# EAGLE design main (EAGLE 9.2.2)
Assembly variants: co

## Sheet 1 of 8: PSU
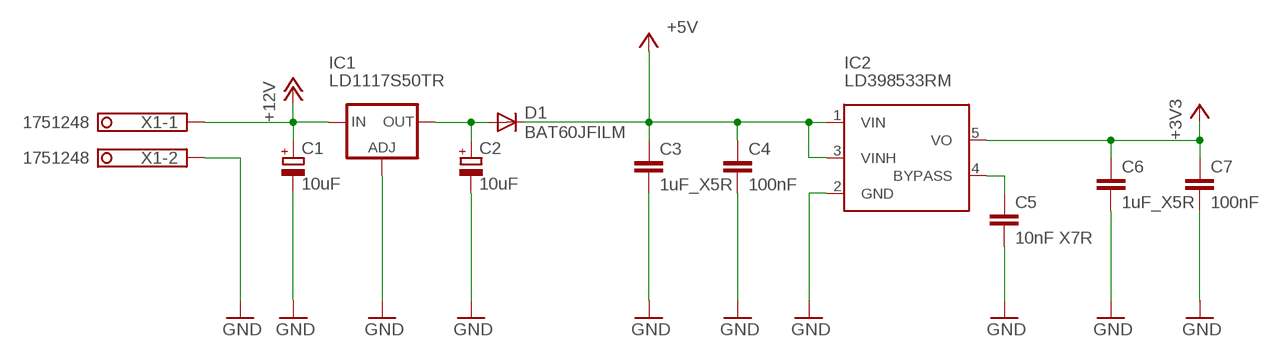
[diagram p0: schematic, sheet 1]

### Parts
C1  10uF  CPOL-EUSMCC  [SMC_C]
C2  10uF  CPOL-EUSMCC  [SMC_C]
C3  1uF_X5R  C-EUC0805  [C0805]
C4  100nF  C-EUC0805  [C0805]
C5  10nF X7R  C-EUC0805  [C0805]
C6  1uF_X5R  C-EUC0805  [C0805]
C7  100nF  C-EUC0805  [C0805]
D1  BAT60JFILM  DIODE-SOD323-W  [SOD323-W]
IC1  LD1117S50TR  LD117AS50TR  [SOT223]
IC2  LD398533RM  [SOT23-5L]
X1  1751248  [1751248]

### Nets
+3V3: C6.1 C7.1 IC2.5(VO) ; also sheet 2,3,4,5,6
+5V: C3.1 C4.1 D1.C IC2.1(VIN) IC2.3(VINH) ; also sheet 2,3,6
+12V [pwr]: C1.+ IC1.3(IN) X1.1 ; also sheet 7
GND [gnd]: C1.- C2.- C3.2 C4.2 C5.2 C6.2 C7.2 IC1.1(ADJ) IC2.2(GND) X1.2 ; also sheet 2,3,4,5,6,7
N$23: C2.+ D1.A IC1.4(OUT)
N$102: C5.1 IC2.4(BYPASS)

## Sheet 2 of 8: MCU
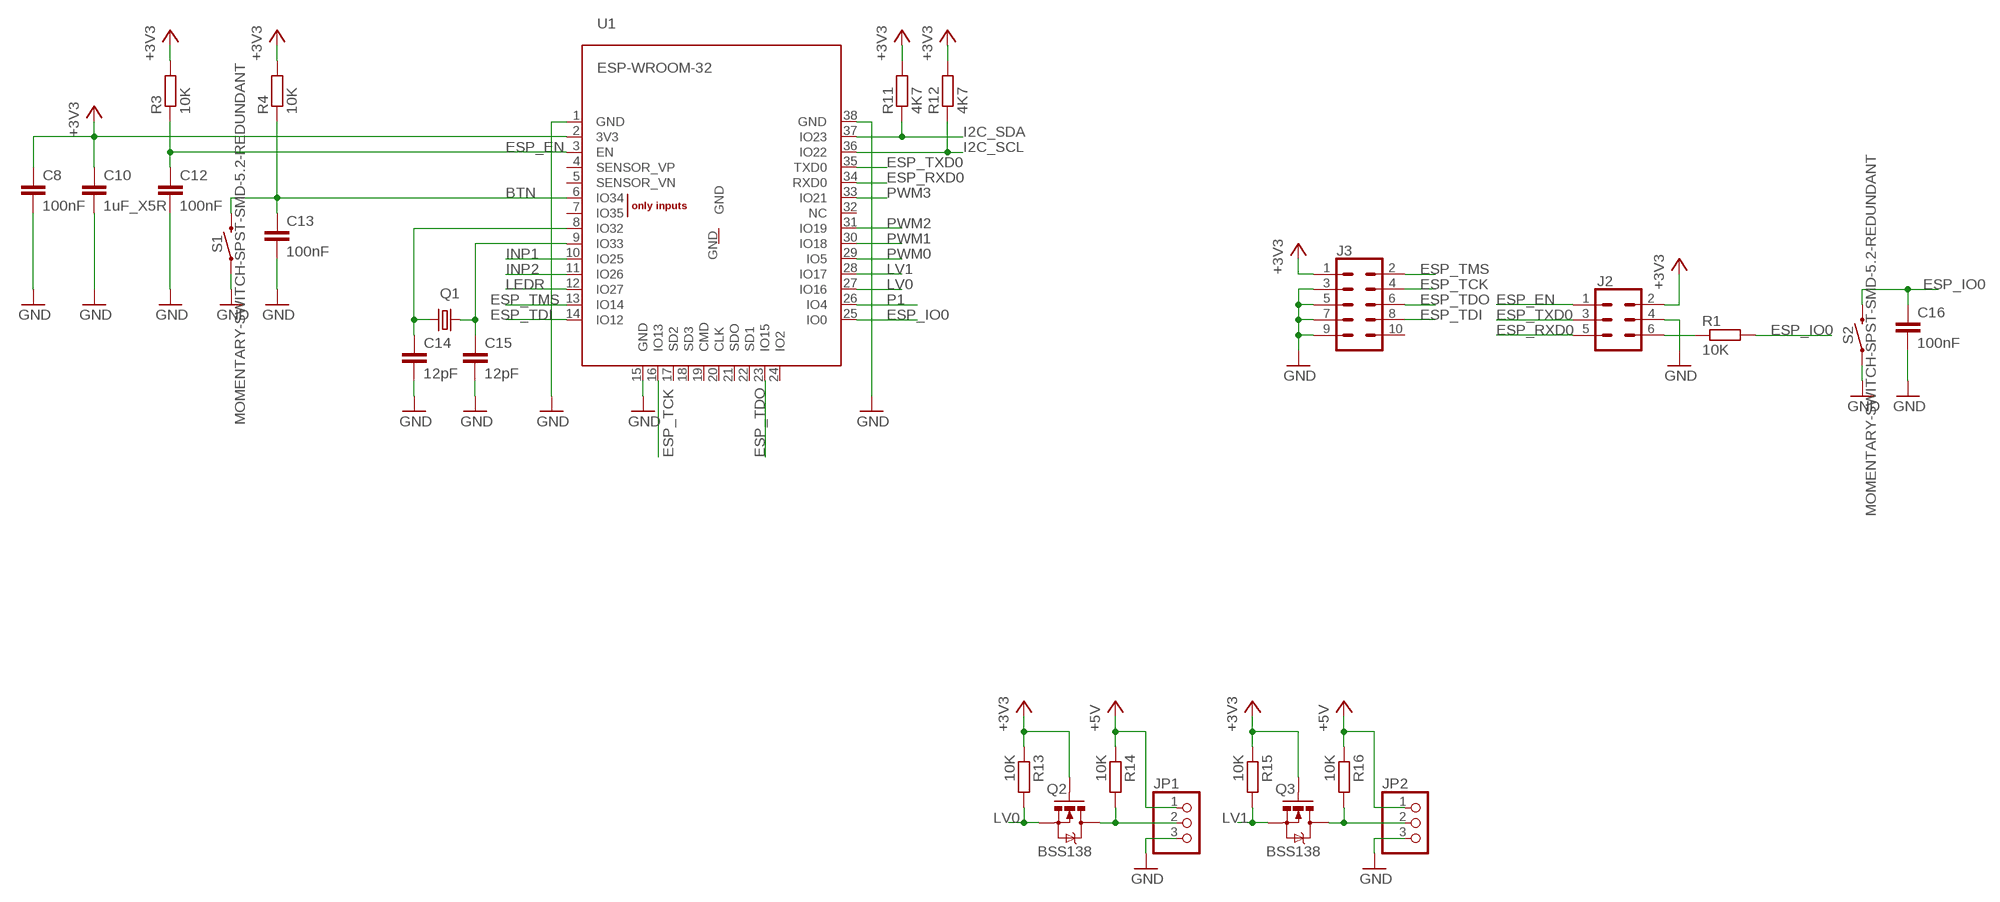
[diagram p1: schematic, sheet 2]

### Parts
C8  100nF  C-EUC0805  [C0805]
C10  1uF_X5R  C-EUC0805  [C0805]
C12  100nF  C-EUC0805  [C0805]
C13  100nF  C-EUC0805  [C0805]
C14  12pF  C-EUC0805  [C0805]
C15  12pF  C-EUC0805  [C0805]
C16  100nF  C-EUC0805  [C0805]
J2  CONN_03X2SHROUD  [2X3-SHROUDED]
J3  CONN_05X2SHD  [2X5-SHROUDED]
JP1  PINHD-1X3  [1X03]
JP2  PINHD-1X3  [1X03]
Q1  CRYSTALTC38H  [TC38H]
Q2  BSS138  MOSFET-NCHANNELSMD  [SOT23-3]
Q3  BSS138  MOSFET-NCHANNELSMD  [SOT23-3]
R1  10K  R-EU_R0805  [R0805]
R3  10K  R-EU_R0805  [R0805]
R4  10K  R-EU_R0805  [R0805]
R11  4K7  R-EU_R0805  [R0805]
R12  4K7  R-EU_R0805  [R0805]
R13  10K  R-EU_R0805  [R0805]
R14  10K  R-EU_R0805  [R0805]
R15  10K  R-EU_R0805  [R0805]
R16  10K  R-EU_R0805  [R0805]
S1  MOMENTARY-SWITCH-SPST-SMD-5.2-REDUNDANT  [TACTILE_SWITCH_SMD_5.2MM]
S2  MOMENTARY-SWITCH-SPST-SMD-5.2-REDUNDANT  [TACTILE_SWITCH_SMD_5.2MM]
U1  ESP-WROOM-32  [ESP-WROOM-32]

### Nets
+3V3: C8.1 C10.1 J2.2 J3.1 Q2.1(G) Q3.1(G) R3.2 R4.2 R11.2 R12.2 R13.1 R15.1 U1.2(3V3) ; also sheet 1,3,4,5,6
+5V: JP1.1 JP2.1 R14.1 R16.1 ; also sheet 1,3,6
BTN: C13.1 R4.1 S1.3 S1.4 U1.6(IO34)
ESP_EN: C12.1 J2.1 R3.1 U1.3(EN)
ESP_IO0: C16.1 R1.2 S2.3 S2.4 U1.25(IO0)
ESP_RXD0: J2.5 U1.34(RXD0)
ESP_TCK: J3.4 U1.16(IO13)
ESP_TDI: J3.8 U1.14(IO12)
ESP_TDO: J3.6 U1.23(IO15)
ESP_TMS: J3.2 U1.13(IO14)
ESP_TXD0: J2.3 U1.35(TXD0)
GND [gnd]: C8.2 C10.2 C12.2 C13.2 C14.2 C15.2 C16.2 J2.4 J3.3 J3.5 J3.7 J3.9 JP1.3 JP2.3 S1.1 S1.2 S2.1 S2.2 U1.1(GND) U1.15(GND) U1.38(GND) ; also sheet 1,3,4,5,6,7
HV1: JP1.2 Q2.3(D) R14.2
HV2: JP2.2 Q3.3(D) R16.2
I2C_SCL: R12.1 U1.36(IO22) ; also sheet 4
I2C_SDA: R11.1 U1.37(IO23) ; also sheet 4
INP1: U1.10(IO25) ; also sheet 3
INP2: U1.11(IO26) ; also sheet 3
LEDR: U1.12(IO27) ; also sheet 5
LV0: Q2.2(S) R13.2 U1.27(IO16)
LV1: Q3.2(S) R15.2 U1.28(IO17)
N$4: J2.6 R1.1
N$38: C14.1 Q1.2 U1.8(IO32)
N$39: C15.1 Q1.1 U1.9(IO33)
P1: U1.26(IO4) ; also sheet 6
PWM0: U1.29(IO5) ; also sheet 7
PWM1: U1.30(IO18) ; also sheet 7
PWM2: U1.31(IO19) ; also sheet 7
PWM3: U1.33(IO21) ; also sheet 7
Unconnected: J3.10 U1.4(SENSOR_VP) U1.5(SENSOR_VN) U1.7(IO35) U1.17(SD2) U1.18(SD3) U1.19(CMD) U1.20(CLK) U1.21(SDO) U1.22(SD1) U1.24(IO2) U1.32(NC) U1.GND

## Sheet 3 of 8: INPUTS
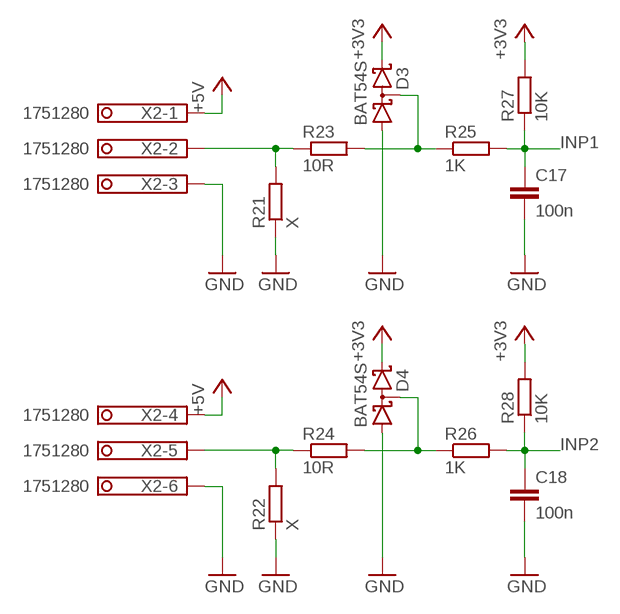
[diagram p2: schematic, sheet 3]

### Parts
C17  100n  C-EUC0805  [C0805]
C18  100n  C-EUC0805  [C0805]
D3  BAT54S  [SOT23]
D4  BAT54S  [SOT23]
R21  X  R-EU_R0805  [R0805]
R22  X  R-EU_R0805  [R0805]  (not fitted in variant co)
R23  10R  R-EU_R0805  [R0805]
R24  10R  R-EU_R0805  [R0805]
R25  1K  R-EU_R0805  [R0805]
R26  1K  R-EU_R0805  [R0805]
R27  10K  R-EU_R0805  [R0805]
R28  10K  R-EU_R0805  [R0805]
X2  1751280  [1751280]

### Nets
+3V3: D3.2(C2) D4.2(C2) R27.2 R28.2 ; also sheet 1,2,4,5,6
+5V: X2.1 X2.4 ; also sheet 1,2,6
GND [gnd]: C17.2 C18.2 D3.1(A1) D4.1(A1) R21.1 R22.1 X2.3 X2.6 ; also sheet 1,2,4,5,6,7
INP1: C17.1 R25.2 R27.1 ; also sheet 2
INP2: C18.1 R26.2 R28.1 ; also sheet 2
N$2: R22.2 R24.1 X2.5
N$3: D3.3(C1A2) R23.2 R25.1
N$8: D4.3(C1A2) R24.2 R26.1
N$20: R21.2 R23.1 X2.2

## Sheet 4 of 8: SENSOR
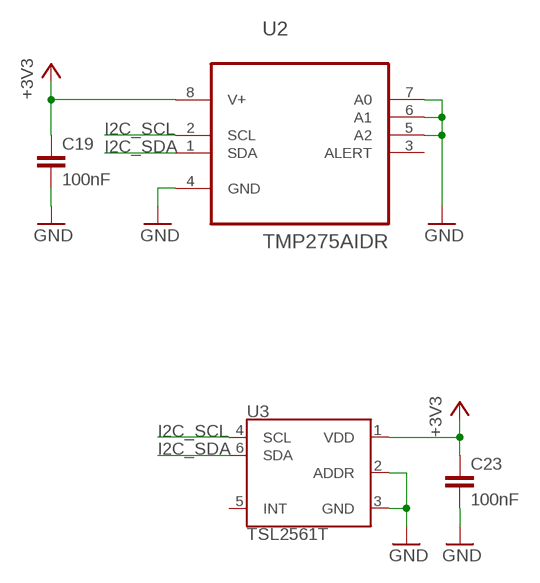
[diagram p3: schematic, sheet 4]

### Parts
C19  100nF  C-EUC0805  [C0805]
C23  100nF  C-EUC0805  [C0805]
U2  TMP275AIDR  [SOIC127P600X175-8N]
U3  TSL2561T  [TMB-6]

### Nets
+3V3: C19.1 C23.1 U2.8(V+) U3.1(VDD) ; also sheet 1,2,3,5,6
GND [gnd]: C19.2 C23.2 U2.4(GND) U2.5(A2) U2.6(A1) U2.7(A0) U3.2(ADDR) U3.3(GND) ; also sheet 1,2,3,5,6,7
I2C_SCL: U2.2(SCL) U3.4(SCL) ; also sheet 2
I2C_SDA: U2.1(SDA) U3.6(SDA) ; also sheet 2
Unconnected: U2.3(ALERT) U3.5(INT)

## Sheet 5 of 8: LED
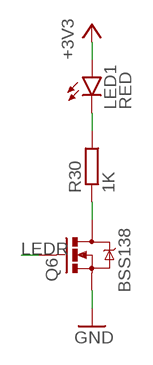
[diagram p4: schematic, sheet 5]

### Parts
LED1  RED  LEDCHIPLED_0805  [CHIPLED_0805]
Q6  BSS138  MOSFET-NCHANNELSMD  [SOT23-3]
R30  1K  R-EU_R0805  [R0805]

### Nets
+3V3: LED1.A ; also sheet 1,2,3,4,6
GND [gnd]: Q6.2(S) ; also sheet 1,2,3,4,6,7
LEDR: Q6.1(G) ; also sheet 2
N$1: Q6.3(D) R30.2
N$5: LED1.C R30.1

## Sheet 6 of 8: P1
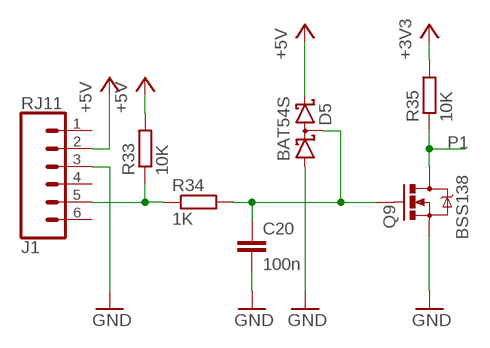
[diagram p5: schematic, sheet 6]

### Parts
C20  100n  C-EUC0805  [C0805]
D5  BAT54S  [SOT23]
J1  RJ11  RJ11-6  [RJ11-6]
Q9  BSS138  MOSFET-NCHANNELSMD  [SOT23-3]
R33  10K  R-EU_R0805  [R0805]
R34  1K  R-EU_R0805  [R0805]
R35  10K  R-EU_R0805  [R0805]

### Nets
+3V3: R35.2 ; also sheet 1,2,3,4,5
+5V: D5.2(C2) J1.2 R33.2 ; also sheet 1,2,3
GND [gnd]: C20.2 D5.1(A1) J1.3 Q9.2(S) ; also sheet 1,2,3,4,5,7
N$26: J1.5 R33.1 R34.1
N$27: C20.1 D5.3(C1A2) Q9.1(G) R34.2
P1: Q9.3(D) R35.1 ; also sheet 2
Unconnected: J1.1 J1.4 J1.6

## Sheet 7 of 8: OUTPUT-DRIVERS
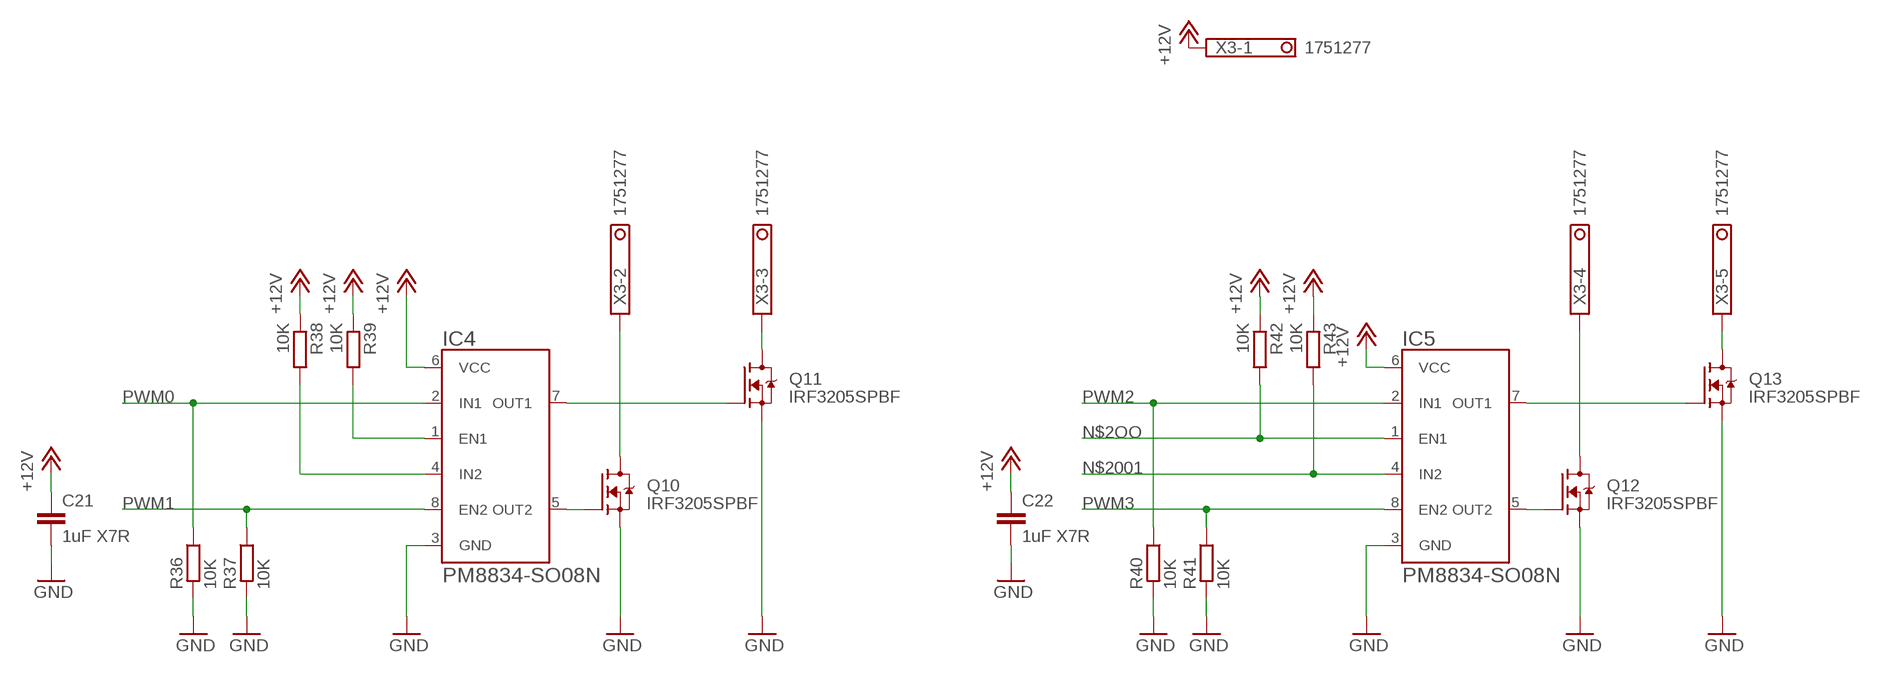
[diagram p6: schematic, sheet 7]

### Parts
C21  1uF X7R  C-EUC0805  [C0805]
C22  1uF X7R  C-EUC0805  [C0805]
IC4  PM8834-SO08N  [SO08N]
IC5  PM8834-SO08N  [SO08N]
Q10  IRF3205SPBF  [TRANS_IRF3205SPBF]
Q11  IRF3205SPBF  [TRANS_IRF3205SPBF]
Q12  IRF3205SPBF  [TRANS_IRF3205SPBF]
Q13  IRF3205SPBF  [TRANS_IRF3205SPBF]
R36  10K  R-EU_R0805  [R0805]
R37  10K  R-EU_R0805  [R0805]
R38  10K  R-EU_R0805  [R0805]
R39  10K  R-EU_R0805  [R0805]
R40  10K  R-EU_R0805  [R0805]
R41  10K  R-EU_R0805  [R0805]
R42  10K  R-EU_R0805  [R0805]
R43  10K  R-EU_R0805  [R0805]
X3  1751277  [1751277]

### Nets
+12V [pwr]: C21.1 C22.1 IC4.6(VCC) IC5.6(VCC) R38.2 R39.2 R42.2 R43.2 X3.1 ; also sheet 1
GND [gnd]: C21.2 C22.2 IC4.3(GND) IC5.3(GND) Q10.3(S) Q11.3(S) Q12.3(S) Q13.3(S) R36.2 R37.2 R40.2 R41.2 ; also sheet 1,2,3,4,5,6
N$2OO: IC5.1(EN1) R42.1
N$7 [pwr]: Q10.2(D) X3.2
N$9: IC4.1(EN1) R39.1
N$10: IC4.4(IN2) R38.1
N$12: IC4.7(OUT1) Q11.1(G)
N$13: IC4.5(OUT2) Q10.1(G)
N$14 [pwr]: Q11.2(D) X3.3
N$15: IC5.7(OUT1) Q13.1(G)
N$16: IC5.5(OUT2) Q12.1(G)
N$17 [pwr]: Q12.2(D) X3.4
N$18 [pwr]: Q13.2(D) X3.5
N$2001: IC5.4(IN2) R43.1
PWM0: IC4.2(IN1) R36.1 ; also sheet 2
PWM1: IC4.8(EN2) R37.1 ; also sheet 2
PWM2: IC5.2(IN1) R40.1 ; also sheet 2
PWM3: IC5.8(EN2) R41.1 ; also sheet 2

## Sheet 8 of 8: OUTLINE
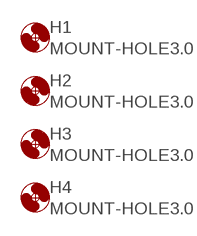
[diagram p7: schematic, sheet 8]

### Parts
H1  MOUNT-HOLE3.0  [3,0]
H2  MOUNT-HOLE3.0  [3,0]
H3  MOUNT-HOLE3.0  [3,0]
H4  MOUNT-HOLE3.0  [3,0]

## Library data of the parts
C1 C2 = resistor:CPOL-EU: POLARIZED CAPACITOR, European symbol
C3-C8 C10 C12-C23 = resistor:C-EU: CAPACITOR, European symbol
D1 = diode:DIODE-: DIODE
D3-D5 = diode:BAT54S: Schottky Diodes Pin connection corrected 2011-05-04 Source: Fairchild .. BAT54.pdf
H1-H4 = holes:MOUNT-HOLE: MOUNTING HOLE with drill center marker
IC1 = v-reg:LD117A?*: Low drop fixed and adjustable positive voltage regulators 1 A Source: http://www.st.com/stonline/products/literature/ds/7194/ld1117axx.pdf
IC2 = st-microelectronics:LD3985: Ultra low drop and low noise BiCMOS voltage regulators Source: www.st.com LD3985.pdf
IC4 IC5 = PM8834:PM8834: ST - PM8834 4A Dual, LowSide, PWM MOSFET Driver. http://www.st.com/stonline/products/literature/ds/15086/pm8834.pdf; AVAILABILITY: Unavailable; DESCRIPTION: PM8834 Series 18 V 4 A 1.3 Ohm SMT Dual Low Side MOSFET Driver - SOIC-8; MF: STMicroelectronics; MP: PM8834; PACKAGE: SOIC-8 STMicroelectronics; PRICE: None
J1 = SparkFun-Connectors:RJ11-6: RJ11 Jack - 6 pin Commonly found on CAT3 devices and some Microchip programmers. Here is the connector we sell at SparkFun: RJ11 6-Pin Connector <https://www.sparkfun.com/products/132> (PRT-00132) Datasheet <http://www.sparkfun.com/datasheets/Prototyping/Connectors/RJ11-Datasheet.pdf> It is used on this SparkFun product: SparkFun Weather Shield <https://www.sparkfun.com/products/12081> (DEV-12081) Weather Meters <https://www.sparkfun.com/products/8942> (SEN-08942); PROD_ID: CONN-08590; SF_ID: PRT-00132
J2 = SparkFun-Connectors:CONN_03X2: Multi connection point. Often used as Generic Header-pin footprint for 0.1 inch spaced/style header connections You can populate with any combo of single row headers, but if you'd like an exact match, check these: Header - 2x3 (Male, 0.1") <https://www.sparkfun.com/products/12807> (PRT-12807) Header - 2x3 (Female, 0.1") <https://www.sparkfun.com/products/13010> (PRT-13010) 2x3 Pin Shrouded Header <https://www.sparkfun.com/products/10877> (PRT-10877) On any of the 0.1 inch spaced packages, you can populate with these: Break Away Headers - Straight <https://www.sparkfun.com/products/116> (PRT-00116) Break Away Male Headers - Right Angle <https://www.sparkfun.com/products/553> (PRT-00553) Female Headers <https://www.sparkfun.com/products/115> (PRT-00115) Break Away Headers - Machine Pin <https://www.sparkfun.com/products/117> (PRT-00117) Break Away Female Headers - Swiss Machine Pin <https://www.sparkfun.com/products/743> (PRT-00743) Special note: the shrouded connector mates well with our 3x2 ribbon cables: Ribbon Crimp Connector - 6-pin (2x3, Female) <https://www.sparkfun.com/products/10651> (PRT-10651) Ribbon Cable - 6 wire (15ft) <https://www.sparkfun.com/products/10646> (PRT-10646); PROD_ID: CONN-10681; SF_ID: PRT_10877
J3 = SparkFun-Connectors:CONN_05X2: Multi connection point. Often used as Generic Header-pin footprint for 0.1 inch spaced/style header connections For AVR SPI programming port, see special device with nice symbol: "AVR_SPI_PROG_5x2.dev" You can populate with any combo of single row headers, but if you'd like an exact match, check these: 2x5 AVR ICSP Male Header <https://www.sparkfun.com/products/778> (PRT-00778) 2x5 Pin Shrouded Header <https://www.sparkfun.com/products/8506> (PRT-08506) On any of the 0.1 inch spaced packages, you can populate with these: Break Away Headers - Straight <https://www.sparkfun.com/products/116> (PRT-00116) Break Away Male Headers - Right Angle <https://www.sparkfun.com/products/553> (PRT-00553) Female Headers <https://www.sparkfun.com/products/115> (PRT-00115) Break Away Headers - Machine Pin <https://www.sparkfun.com/products/117> (PRT-00117) Break Away Female Headers - Swiss Machine Pin <https://www.sparkfun.com/products/743> (PRT-00743) Special note: the shrouded connector mates well with our 5x2 ribbon cables: 2x5 Pin IDC Ribbon Cable <https://www.sparkfun.com/products/8535> (PRT-08535); PROD_ID: CONN-08671; SF_ID: PRT-08506
JP1 JP2 = adafruit:PINHD-1X3: PIN HEADER
LED1 = led:LED: LED OSRAM: - CHIPLED LG R971, LG N971, LY N971, LG Q971, LY Q971, LO R971, LY R971 LH N974, LH R974 LS Q976, LO Q976, LY Q976 LO Q996 - Hyper CHIPLED LW Q18S LB Q993, LB Q99A, LB R99A - SideLED LS A670, LO A670, LY A670, LG A670, LP A670 LB A673, LV A673, LT A673, LW A673 LH A674 LY A675 LS A676, LA A676, LO A676, LY A676, LW A676 LS A679, LY A679, LG A679 - Hyper Micro SIDELED® LS Y876, LA Y876, LO Y876, LY Y876 LT Y87S - SmartLED LW L88C, LW L88S LB L89C, LB L89S, LG L890 LS L89K, LO L89K, LY L89K LS L896, LA L896, LO L896, LY L896 - TOPLED LS T670, LO T670, LY T670, LG T670, LP T670 LSG T670, LSP T670, LSY T670, LOP T670, LYG T670 LG T671, LOG T671, LSG T671 LB T673, LV T673, LT T673, LW T673 LH T674 LS T676, LA T676, LO T676, LY T676, LB T676, LH T676, LSB T676, LW T676 LB T67C, LV T67C, LT T67C, LS T67K, LO T67K, LY T67K, LW E67C LS E67B, LA E67B, LO E67B, LY E67B, LB E67C, LV E67C, LT E67C LW T67C LS T679, LY T679, LG T679 LS T770, LO T770, LY T770, LG T770, LP T770 LB T773, LV T773, LT T773, LW T773 LH T774 LS E675, LA E675, LY E675, LS T675 LS T776, LA T776, LO T776, LY T776, LB T776 LHGB T686 LT T68C, LB T68C - Hyper Mini TOPLED® LB M676 - Mini TOPLED Santana® LG M470 LS M47K, LO M47K, LY M47K Source: http://www.osram.convergy.de LUXEON: - LUMILED® LXK2-PW12-R00, LXK2-PW12-S00, LXK2-PW14-U00, LXK2-PW14-V00 LXK2-PM12-R00, LXK2-PM12-S00, LXK2-PM14-U00 LXK2-PE12-Q00, LXK2-PE12-R00, LXK2-PE12-S00, LXK2-PE14-T00, LXK2-PE14-U00 LXK2-PB12-K00, LXK2-PB12-L00, LXK2-PB12-M00, LXK2-PB14-N00, LXK2-PB14-P00, LXK2-PB14-Q00 LXK2-PR12-L00, LXK2-PR12-M00, LXK2-PR14-Q00, LXK2-PR14-R00 LXK2-PD12-Q00, LXK2-PD12-R00, LXK2-PD12-S00 LXK2-PH12-R00, LXK2-PH12-S00 LXK2-PL12-P00, LXK2-PL12-Q00, LXK2-PL12-R00 Source: www.luxeon.com KINGBRIGHT: KA-3528ASYC Source: www.kingbright.com
Q1 = crystal:CRYSTAL: CRYSTAL; OC_FARNELL: unknown; OC_NEWARK: unknown
Q2 Q3 Q6 Q9 = SparkFun:MOSFET-NCHANNEL
Q10-Q13 = IRF3205SPBF:IRF3205SPBF: Single N-Channel 55 V 200 W 146 nC Hexfet Power Mosfet Surface Mount - D2PAK-3; AVAILABILITY: Unavailable; DESCRIPTION: Single N-Channel 55 V 200 W 146 nC Hexfet Power Mosfet Surface Mount - D2PAK-3; MF: Infineon Technologies; MP: IRF3205SPBF; PACKAGE: D2PAK Infineon; PRICE: None
R1 R3 R4 R11-R16 R21-R28 R30 R33-R43 = resistor:R-EU_: RESISTOR, European symbol
S1 S2 = SparkFun-Switches:MOMENTARY-SWITCH-SPST: Momentary Switch (Pushbutton) - SPST Normally-open (NO) SPST momentary switches (buttons, pushbuttons). Variants PTH-12MM - 12mm square, through-hole Momentary Pushbutton Switch - 12mm Square <https://www.sparkfun.com/products/9190> (COM-09190) PTH-6.0MM, PTH-6.0MM-KIT - 6.0mm square, through-hole Mini Pushbutton Switch <https://www.sparkfun.com/products/97> (COM-00097) KIT package intended for soldering kit's - only one side of pads' copper is exposed. PTH-RIGHT-ANGLE-KIT - Right-angle, through-hole Right Angle Tactile Button <https://www.sparkfun.com/products/10791> - Used on SparkFun BigTime Watch Kit <https://www.sparkfun.com/products/11734> SMD-12MM - 12mm square, surface-mount Tactile Button - SMD (12mm) <https://www.sparkfun.com/products/12993> (COM-12993) Used on SparkFun PicoBoard <https://www.sparkfun.com/products/11888> SMD-4.5MM - 4.5mm Square Trackball Switch Used on SparkFun Blackberry Trackballer Breakout <https://www.sparkfun.com/products/13169> SMD-4.6MMX2.8MM - 4.60mm x 2.80mm, surface mount Used on SparkFun SAMD21 Mini Breakout <https://www.sparkfun.com/products/13664> SMD-5.2MM, SMD-5.2-REDUNDANT - 5.2mm square, surface-mount Mini Pushbutton Switch - SMD <https://www.sparkfun.com/products/8720> (COM-08720) Used on Arduino Pro Mini <https://www.sparkfun.com/products/11114> REDUNDANT package connects both switch circuits together SMD-6.0X3.5MM - 6.0 x 3.5mm, surface mount Momentary Reset Switch SMD <https://www.sparkfun.com/products/8229> (COM-08229) SMD-6.2MM-TALL - 6.2mm square, surface mount Tactile Button - SMD (6mm) <https://www.sparkfun.com/products/12992> Used on SparkFun Digital Sandbox <https://www.sparkfun.com/products/12651> SMD-RIGHT-ANGLE - Right-angle, surface mount Used on SparkFun Block for Intel® Edison - Arduino <https://www.sparkfun.com/products/13036>; PROD_ID: SWCH-08247; SF_SKU: COM-08720
U1 = esp32:ESP-WROOM-32
U2 = TMP275AIDR:TMP275AIDR: 0.5°C Digital Out Temperature Sensor; AVAILABILITY: Unavailable; DESCRIPTION: ?0.5?C _max_ Temperature Sensor with I2C/SMBus Interface in Industry Standard LM75 Form Factor & Pin 8-SOIC -40 to 125; MF: Texas Instruments; MP: TMP275AIDR; PACKAGE: SOIC-8 Texas Instruments; PRICE: None
U3 = SparkFun-Sensors:TSL2561: TAOS TSL2561 Digital Luminosity (Light) Sensor The TSL2561 is a light-to-digital converter that transform light intensity to a digital signal output via I2C interface. The device combines one broadband photodiode (visible plus infrared) and one infrared-responding photodiode on a single CMOS integrated circuit capable of providing a near-photopic response over an effective 20-bit dynamic range (16-bit resolution). Two integrating ADCs convert the photodiode currents to a digital output that represents the irradiance measured on each channel. This digital output can be input to a microprocessor where illuminance (ambient light level) in lux is derived using an empirical formula to approximate the human eye response. The TSL2561 device supports a traditional level style interrupt that remains asserted until the firmware clears it. Datasheet <http://www.mouser.com/ds/2/588/ams_sl2560-e58-488842.pdf> SparkFun Products SparkFun Luminosity Sensor Breakout - TSL2561 <https://www.sparkfun.com/products/12055> (SEN-12055)
X1 = con-phoenix-350:1751248: MKDS 1/ 2-3,5 Printklemme Nennstrom: 10 A Bemessungsspannung: 160 V Raster: 3,5 mm Polzahl: 2 Montageart: Löten Anschlussart: Schraubanschluss Anschlussrichtung vom Leiter zur Platine: 0° Source: http://eshop.phoenixcontact.com .. 1751248.pdf; OC_FARNELL: unknown; OC_NEWARK: unknown
X2 = con-phoenix-350:1751280: MKDS 1/ 6-3,5 Printklemme Nennstrom: 10 A Bemessungsspannung: 160 V Raster: 3,5 mm Polzahl: 6 Montageart: Löten Anschlussart: Schraubanschluss Anschlussrichtung vom Leiter zur Platine: 0° Source: http://eshop.phoenixcontact.com .. 1751280.pdf; MPN: 1751280; OC_FARNELL: unknown; OC_NEWARK: 27R1765
X3 = con-phoenix-350:1751277: MKDS 1/ 5-3,5 Printklemme Nennstrom: 10 A Bemessungsspannung: 160 V Raster: 3,5 mm Polzahl: 5 Montageart: Löten Anschlussart: Schraubanschluss Anschlussrichtung vom Leiter zur Platine: 0° Source: http://eshop.phoenixcontact.com .. 1751277.pdf; OC_FARNELL: unknown; OC_NEWARK: unknown

## Net classes
0 default: width 0.305 mm
1 pwr: width 0.305 mm
2 gnd: width 0.305 mm, drill 0.559 mm, clearance 0.152 mm

## Board
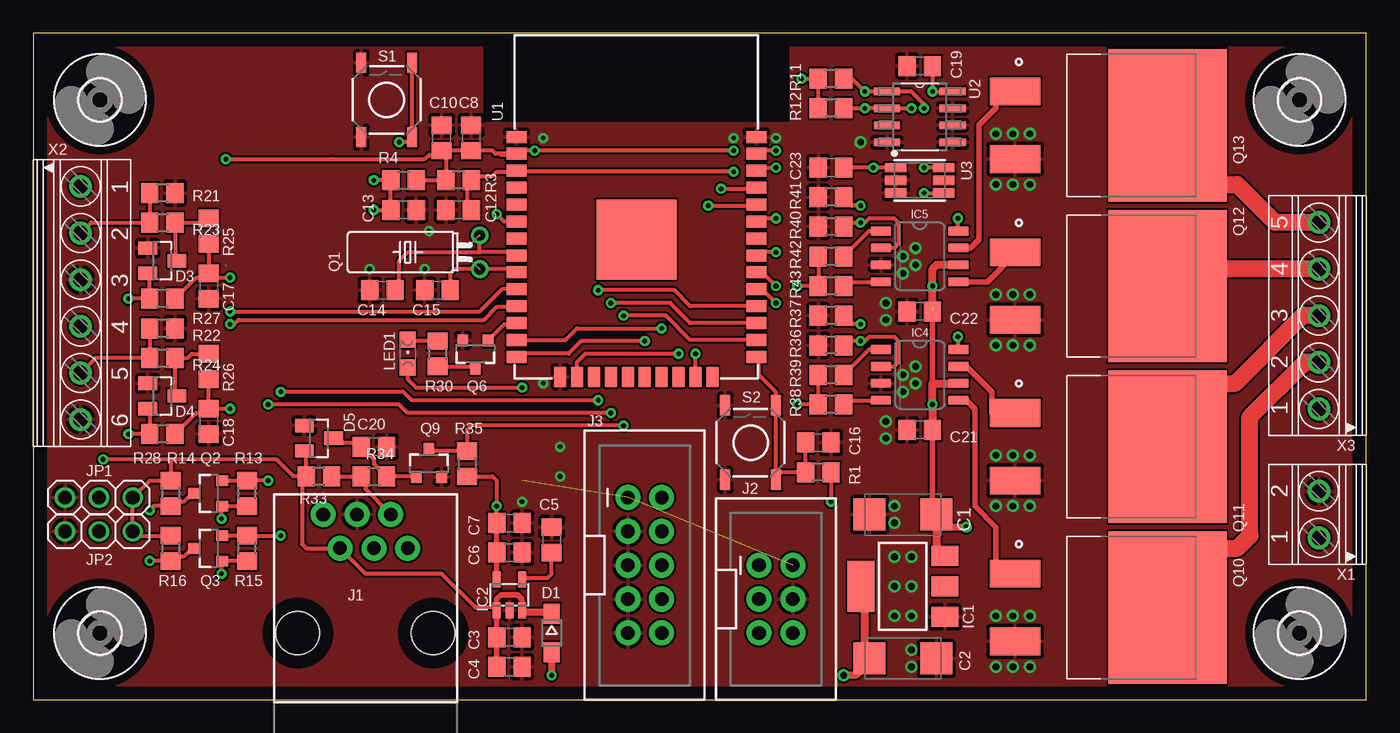
[diagram p8: board, top side]
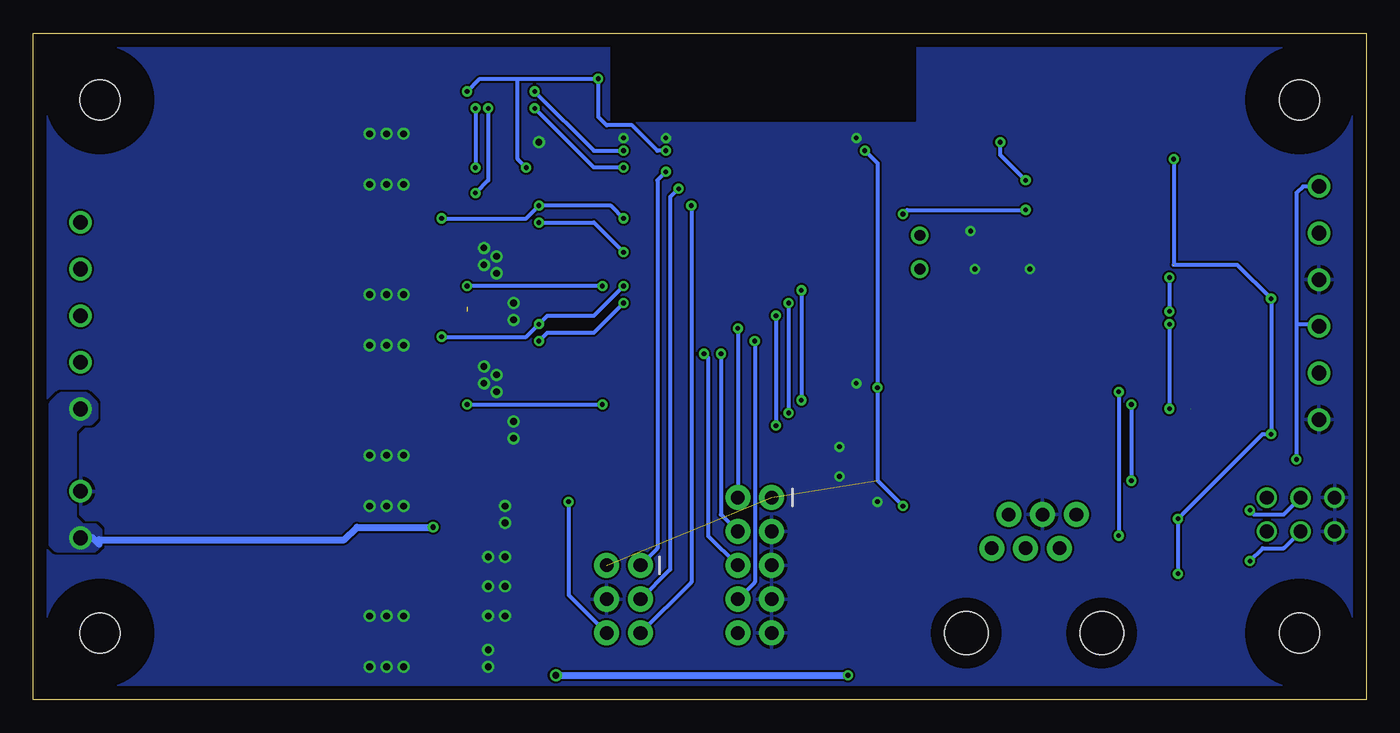
[diagram p9: board, bottom side, seen from below]

Size 100 x 50 mm. Coordinates in mm from the lower left corner, seen from the top.
Outline: 0,0 100,0 100,50 0,50 0,0
Copper layers (1*16): Top 0.035mm / dielectric 1.5mm / Bottom 0.035mm
Design rules "default": minimum track width 6mil, minimum drill 0.35mm, track to track 6mil, track to pad 6mil, pad to pad 6mil, via to via 6mil, smd to smd 6mil, copper to edge 40mil, drill to drill 6mil, minimum pad ring 10mil, minimum via ring 8mil, stop-mask expansion 4mil, vias tented up to drill 0mil, thermal gap 10mil

### Footprints (pad centres in the part's own frame; a part is rotated, then mirrored left to right if it is on the bottom)
SMC_C = smd 2.4 x 2.4: + -2.5,0; - 2.5,0
C0805 = smd 1.3 x 1.5: 1 -0.95,0; 2 0.95,0
SOD323-W = smd 1.5 x 1.2: A 1.45,0; C -1.45,0
SOT23 = smd 1 x 1.4: 1 -0.95,-1.1; 2 0.95,-1.1; 3 0,1.1
3,0 = hole 3: 0,0
SOT223 = smd 1.5 x 2: 1 -2.3,-3.15; 2 0,-3.15; 3 2.3,-3.15 | smd 3.8 x 2: 4 0,3.15
SOT23-5L = smd 0.6 x 1.2: 1 -0.95,-1.15; 2 0,-1.15; 3 0.95,-1.15; 4 0.95,1.15; 5 -0.95,1.15
SO08N = smd 0.65 x 1.5: 1 -1.905,-2.9; 2 -0.635,-2.9; 3 0.635,-2.9; 4 1.905,-2.9; 5 1.905,2.9; 6 0.635,2.9; 7 -0.635,2.9; 8 -1.905,2.9
RJ11-6 = drill 1.016 pad 1.88: 1 -3.175,8.89; 2 -1.905,6.35; 3 -0.635,8.89; 4 0.635,6.35; 5 1.905,8.89; 6 3.175,6.35 | hole 3.251: -5.08,0; 5.08,0
2X3-SHROUDED = drill 1.016 pad 1.88: 1 -1.27,2.54; 2 1.27,2.54; 3 -1.27,0; 4 1.27,0; 5 -1.27,-2.54; 6 1.27,-2.54
2X5-SHROUDED = drill 1.016 pad 1.88: 1 -1.27,5.08; 2 1.27,5.08; 3 -1.27,2.54; 4 1.27,2.54; 5 -1.27,0; 6 1.27,0; 7 -1.27,-2.54; 8 1.27,-2.54; 9 -1.27,-5.08; 10 1.27,-5.08
1X03 = drill 1.016: 1 -2.54,0; 2 0,0; 3 2.54,0
CHIPLED_0805 = smd 1.2 x 1.2: A 0,-1.05; C 0,1.05
TC38H = drill 0.813: 1 -1.27,0; 2 1.27,0
SOT23-3 = smd 0.8 x 0.9: 1 -0.95,-1; 2 0.95,-1; 3 0,1.1
TRANS_IRF3205SPBF = smd 2.08 x 3.81: 1 -2.54,-7.14; 3 2.54,-7.14 | smd 11.43 x 8.89: 2 0,4.29
R0805 = smd 1.3 x 1.5: 1 -0.95,0; 2 0.95,0
TACTILE_SWITCH_SMD_5.2MM = smd 1.524 x 0.762: 1 -2.794,1.905; 2 2.794,1.905; 3 -2.794,-1.905; 4 2.794,-1.905
ESP-WROOM-32 = smd 0.9 x 1.5: 1 7.7,9; 2 6.43,9; 3 5.16,9; 4 3.89,9; 5 2.62,9; 6 1.35,9; 7 0.08,9; 8 -1.19,9; 9 -2.46,9; 10 -3.73,9; 11 -5,9; 12 -6.27,9; 13 -7.54,9; 14 -8.81,9; 25 -8.81,-9; 26 -7.54,-9; 27 -6.27,-9; 28 -5,-9; 29 -3.73,-9; 30 -2.46,-9; 31 -1.19,-9; 32 0.08,-9; 33 1.35,-9; 34 2.62,-9; 35 3.89,-9; 36 5.16,-9; 37 6.43,-9; 38 7.7,-9 | smd 1.5 x 0.9: 15 -10.3,5.715; 16 -10.3,4.445; 17 -10.3,3.175; 18 -10.3,1.905; 19 -10.3,0.635; 20 -10.3,-0.635; 21 -10.3,-1.905; 22 -10.3,-3.175; 23 -10.3,-4.445; 24 -10.3,-5.715 | smd 6 x 6: GND 0,0
SOIC127P600X175-8N = smd 1.981 x 0.559: 1 -2.464,1.905; 2 -2.464,0.635; 3 -2.464,-0.635; 4 -2.464,-1.905; 5 2.464,-1.905; 6 2.464,-0.635; 7 2.464,0.635; 8 2.464,1.905
TMB-6 = smd 1.6 x 0.7: 1 -1.8,0.95; 2 -1.8,0; 3 -1.8,-0.95; 4 1.8,-0.95; 5 1.8,0; 6 1.8,0.95
1751248 = drill 1.1 pad 1.7: 1 -1.75,-0.1; 2 1.75,-0.1
1751280 = drill 1.1 pad 1.7: 1 -8.75,-0.1; 2 -5.25,-0.1; 3 -1.75,-0.1; 4 1.75,-0.1; 5 5.25,-0.1; 6 8.75,-0.1
1751277 = drill 1.1 pad 1.7: 1 -7,-0.1; 2 -3.5,-0.1; 3 0,-0.1; 4 3.5,-0.1; 5 7,-0.1

### Placement (x,y rotation side)
C1  65.24,13.89 180 top
C2  65.24,3.09 0 top
C3  35.71,4.68 0 top
C4  35.71,2.46 0 top
C5  38.89,11.98 90 top
C6  35.71,11.03 0 top
C7  35.71,13.25 0 top
C8  32.86,42.14 90 top
C10  30.63,42.14 90 top
C12  31.9,36.75 180 top
C13  27.77,36.75 0 top
C14  26.19,30.71 180 top
C15  30.32,30.71 180 top
C16  58.89,19.29 0 top
C17  13.17,31.03 270 top
C18  13.17,20.87 270 top
C19  66.51,47.54 180 top
C20  25.55,18.97 0 top
C21  66.51,20.24 180 top
C22  66.51,29.13 180 top
C23  59.84,39.92 180 top
D1  38.89,5 270 top
D3  9.68,32.94 270 top
D4  9.68,22.78 270 top
D5  21.43,19.6 270 top
H1  95,45 0 top
H2  95,5 0 top
H3  5,5 0 top
H4  5,45 0 top
IC1  65.24,8.49 90 top
IC2  35.71,7.86 0 top
IC4  66.51,24.36 270 top
IC5  66.51,33.26 270 top
J1  24.92,5 0 top
J2  55.72,7.54 0 top
J3  45.87,10.08 0 top
JP1  4.91,15.16 180 top
JP2  4.91,12.62 180 top
LED1  28.09,25.95 0 top
Q1  33.49,33.57 90 top
Q2  13.17,15.47 90 top
Q3  13.17,11.35 90 top
Q6  33.17,25.95 180 top
Q9  29.68,17.7 0 top
Q10  80.8,6.9 270 top
Q11  80.8,18.97 270 top
Q12  80.8,31.03 270 top
Q13  80.8,43.1 270 top
R1  58.89,17.06 180 top
R3  31.9,38.97 180 top
R4  27.77,38.97 0 top
R11  59.84,46.59 180 top
R12  59.84,44.37 180 top
R13  16.03,15.47 90 top
R14  10.31,15.47 270 top
R15  16.03,11.35 90 top
R16  10.31,11.35 270 top
R21  9.68,38.02 180 top
R22  9.68,27.86 180 top
R23  9.68,35.8 0 top
R24  9.68,25.64 0 top
R25  13.17,35.16 270 top
R26  13.17,25 270 top
R27  9.68,30.08 180 top
R28  9.68,19.92 180 top
R30  30.32,25.95 270 top
R33  21.43,16.74 180 top
R34  25.55,16.74 0 top
R35  32.54,17.7 270 top
R36  59.84,26.59 180 top
R37  59.84,28.81 180 top
R38  59.84,22.14 180 top
R39  59.84,24.36 180 top
R40  59.84,35.48 180 top
R41  59.84,37.7 180 top
R42  59.84,33.26 180 top
R43  59.84,31.03 180 top
S1  26.5,45 90 top
S2  53.81,19.29 90 top
U1  45.24,34.52 90 top
U2  66.51,43.73 0 top
U3  66.51,38.97 0 top
X1  96.35,13.89 90 top
X2  3.65,29.76 270 top
X3  96.35,28.81 90 top

### Tracks (layer width: path | path; a pad name or v marks a point on that pad's centre or on a via)
+3V3  (via drill 0.35)  (3 unrouted)
  Top 0.305: 8.73,32.3 8.81,32.22 D3.2 8.73,31.84 8.73,31.03 R27.2 | R27.2 | C19.1 v67.46,45.64 U2.8 | D4.2 8.73,21.68 R28.2 v7.14,19.92 | R27.2 v7.14,30.08 | C10.1 | C10.1 C8.1 34.44,41.2 34.68,40.95 U1.2 | C10.1 30.95,41.08 R3.2 R4.2 28.41,39.28 | R12.2 R11.2 v57.62,46.59 | R13.1 15.4,14.53 15.39,14.52 Q2.1 | R15.1 Q3.1 14.12,10.35 v14.12,9.44 | Q2.1 | v14.12,13.57 14.12,14.47 Q2.1 | U1.2 35.79,40.95 35.71,40.88 35.08,40.88 | v14.44,40.56 22.38,40.56 29.36,40.56 29.68,40.88 30.31,40.88 C10.1 | v52.54,41.19 v37.62,41.19 36.48,41.19 U1.2 | C7.1 v34.76,14.52 34.76,16.43 34.44,16.75 R35.2 | U3.1 v63.02,39.92 C23.1 | v36.66,23.41 28.73,23.41 28.09,24.05 LED1.A
  Top 0.406: IC2.5 C6.1 C7.1
  Top 0.508: C7.1 | C6.1
  Bottom 0.305: v67.46,45.64 66.51,46.59 63.65,46.59 | 63.65,46.59 v57.62,46.59 57.62,43.73 56.98,43.1 55.08,43.1 53.17,41.19 v52.54,41.19 | v14.12,9.44 v14.12,13.57 7.77,19.92 v7.14,19.92 v7.14,30.08 9.68,32.62 14.45,32.62 | v37.62,41.19 36.66,40.24 v36.66,23.41 36.66,17.06 36.66,16.43 v34.76,14.52 | v14.44,40.56 14.44,32.62 | v63.02,39.92 63.65,40.56 63.65,46.59
+5V  (via drill 0.35)
  Top 0.305: D5.2 20.47,18.5 20.47,17.7 20.48,17.7 R33.2 | R33.2 20.16,16.43 20.16,11.66 20.47,11.35 J1.2 24.92,9.44 30.63,9.44 33.17,6.9 34.56,6.9 IC2.1 | R16.1 7.77,12.3 JP2.1 JP1.1 8.72,16.43 R14.1 10.31,18.02 | R33.2 19.52,16.74 18.25,18.02 10.31,18.02 | 10.31,18.02 v5.23,18.02
  Top 0.406: 36.78,6.59 IC2.3 36.66,7.54 36.35,7.86 35.08,7.86 34.76,7.54 IC2.1 C3.1 34.76,4.05 34.76,4.04 C4.1
  Top 0.508: 39.02,6.59 D1.C 38.75,6.59 36.78,6.59
  Bottom 0.305: X2.1 4.74,38.51 5.23,38.02 5.23,28.18 | 5.23,28.18 3.71,28.18 X2.4 | 5.23,28.18 v5.23,18.02
+12V  (via drill 0.35, 0.4)  (1 unrouted)
  Top 0.305: v57.3,22.14 R38.2 R39.2 | R42.2 R43.2 v57.3,31.03
  Top 0.406: 67.46,23.73 67.46,29.44 | C21.1 67.46,14.16 C1.+
  Top 0.508: v70,12.94 67.78,12.94
  Top 0.61: IC1.3 67.78,11.4 67.78,12.94 67.78,13.85 C1.+ | IC4.6 67.46,23.73 v67.46,22.14 C21.1 | IC5.6 67.78,32.62 67.46,32.3 v67.46,31.03 67.46,29.44
  Bottom 0.305: v67.46,22.14 v57.3,22.14 | v57.3,31.03 v67.46,31.03
  Bottom 0.406: 95.09,11.66 95.09,11.98
  Bottom 0.508: X1.1 95.56,12.14 95.09,11.66 | v70,12.94 75.72,12.94 76.67,11.98 95.09,11.98
  pour Bottom (no thermals): 95.09,12.62 95.4,12.94 96.35,12.94 96.99,13.57 96.99,20.24 96.35,20.87 95.72,20.87 95.4,21.19 95.4,22.14 96.04,22.78 97.94,22.78 98.58,22.14 98.58,11.66 98.26,11.35 95.4,11.35 95.09,11.66
BTN  (via drill 0.35)
  Top 0.305: U1.6 35.31,35.88 v34.76,36.43 | v25.55,36.75 C13.1 26.82,37.06 R4.1 v25.55,38.97 | 28.41,41.83 S1.3 | S1.3 S1.4 | S1.3 28.41,41.89 28.35,41.83 v27.46,41.83
  Bottom 0.305: v34.76,36.43 34.44,36.75 25.87,36.75 v25.55,36.75 | v25.55,38.97 27.46,40.88 v27.46,41.83
ESP_EN  (via drill 0.35)
  Top 0.305: C12.1 32.54,37.06 32.54,38.97 R3.1 33.17,39.29 34.44,39.29 34.76,39.61 36.16,39.61 U1.3 36.32,39.61 v52.54,39.61
  Bottom 0.305: J2.1 53.17,11.35 53.17,38.97 v52.54,39.61
ESP_IO0
  Top 0.305: S2.3 55.72,16.74 55.72,17.06 | 55.72,17.06 55.72,17.38 S2.4 55.72,23.09 54.45,24.36 54.45,25.51 U1.25 | R1.2 57.94,18.02 | R1.2 C16.1 | R1.2 55.72,17.06
ESP_RXD0  (via drill 0.35)
  Top 0.305: U1.34 54.16,37.06 v50.63,37.06
  Bottom 0.305: J2.5 50.63,8.81 v50.63,37.06
ESP_TCK  (via drill 0.35)
  Top 0.305: U1.16 40.79,25.32 41.43,25.95 v48.41,25.95
  Bottom 0.305: J3.4 48.41,13.89 v48.41,25.95
ESP_TDI  (via drill 0.35)
  Top 0.305: U1.14 36.48,25.95 40.16,25.95 41.11,26.91 v45.87,26.91
  Bottom 0.305: J3.8 45.87,8.81 v45.87,26.91
ESP_TDO  (via drill 0.35)
  Top 0.305: U1.23 v49.68,25.95
  Bottom 0.305: J3.6 49.37,12.3 49.37,25.64 v49.68,25.95
ESP_TMS  (via drill 0.35)
  Top 0.305: U1.13 39.92,26.98 40.79,27.86 v47.14,27.86
  Bottom 0.305: v47.14,27.86 J3.2
ESP_TXD0  (via drill 0.35)
  Top 0.305: v51.59,38.34 54.16,38.34 U1.35
  Bottom 0.305: J2.3 52.22,9.76 52.22,37.7 v51.59,38.34
GND  (via drill 0.35, 0.5)
  other vias: 72.22,26.59 73.5,26.59 74.77,26.59 72.22,30.4 73.5,30.4 74.77,30.4 72.22,18.33 73.5,18.33 74.77,18.33 74.77,14.52 73.5,14.52 72.22,14.52 72.22,6.27 73.5,6.27 74.77,6.27 74.77,2.46 73.5,2.46 72.22,2.46 72.22,42.46 73.5,42.46 74.77,42.46 74.77,38.65 73.5,38.65 72.22,38.65 65.24,23.09 65.24,24.36 66.19,23.73 65.24,31.98 65.24,33.26 66.19,32.62 65.88,6.27 65.88,8.49 65.88,10.71 63.97,29.76 63.97,19.6 63.97,28.49 63.97,20.87 66.19,33.89 66.19,25 38.25,42.14 52.54,42.14 29.68,35.16 36.66,14.84 39.52,16.74 39.52,18.97 64.61,6.27 64.61,8.49 64.61,10.71 65.88,2.46 65.88,3.73 64.61,13.25 64.61,14.52 62.06,41.83 29.36,32.3 25.23,32.3 38.25,23.73 55.72,42.14
  pour Top: 0.47,50.4 100.8,50.4 100.8,-0.4 -0.8,-0.4 -0.8,50.4
  pour Bottom (rank 2): -1.12,50.72 101.12,50.72 101.12,-0.72 -1.12,-0.72
  pour Top (no thermals): 64.92,32.3 64.92,35.48 65.24,35.8
HV1  (via drill 0.35)
  Top 0.305: Q2.3 11.9,15.47 11.27,14.84 10.63,14.84 R14.2 9.05,14.53 v8.73,14.21
  Bottom 0.305: v8.73,14.21 8.41,13.89 6.19,13.89 JP1.2
HV2  (via drill 0.35)
  Top 0.305: Q3.3 11.9,11.35 11.27,10.71 10.63,10.71 R16.2 v8.73,10.4 v8.73,10.39
  Bottom 0.305: v8.73,10.39 7.77,11.35 6.19,11.35 JP2.2
I2C_SCL  (via drill 0.35)
  Top 0.305: R12.1 v62.38,44.37 U2.2 v65.88,44.37 | U1.36 54.52,39.69 54.76,39.92 v55.72,39.92 | v66.83,38.02 U3.4
  Bottom 0.305: v62.38,44.37 57.94,39.92 v55.72,39.92 | v66.83,38.02 65.88,38.97 v65.88,44.37
I2C_SDA  (via drill 0.35)
  Top 0.305: v55.72,41.19 54.48,41.19 U1.37 | R11.1 61.43,46.59 v62.38,45.64 U2.1 65.88,45.64 66.83,44.69 v66.83,44.37 | U3.6 v66.83,39.92
  Bottom 0.305: v62.38,45.64 57.94,41.19 v55.72,41.19 | v66.83,44.37 v66.83,39.92
INP1  (via drill 0.35)
  Top 0.305: R27.1 | R27.1 | R27.1 10.95,30.4 | R27.1 12.22,31.67 12.85,31.67 C17.1 | R25.2 C17.1 | C17.1 13.49,31.98 13.8,31.67 v14.76,31.67 | v14.76,29.13 33.49,29.13 35.16,30.8 U1.10
  Bottom 0.305: v14.76,31.67 v14.76,29.13
INP2  (via drill 0.35)  (1 unrouted)
  Top 0.305: 10.95,19.6 10.79,19.76 | R28.1 10.79,19.76 | 10.63,19.6 10.79,19.76 | R28.1 10.95,20.24 | R26.2 C18.1 12.85,21.51 12.22,21.51 R28.1 | v14.76,21.82 C18.1 | v14.76,28.18 15.08,28.18 15.39,28.49 33.81,28.49 34.76,29.45 36.16,29.45 U1.11
  Bottom 0.305: v14.76,28.18 v14.76,21.82
LEDR
  Top 0.305: Q6.1 35.34,28.18 36.16,28.18 U1.12
LV0  (via drill 0.35)
  Top 0.305: Q2.2 R13.2 v17.62,16.43 | 54.16,28.18 U1.27 49.28,28.25 47.78,29.76 v43.33,29.76 | v17.62,22.14 27.46,22.14 28.09,21.51 v43.33,21.51
  Bottom 0.305: v17.62,22.14 v17.62,16.43 | v43.33,29.76 v43.33,21.51
LV1  (via drill 0.35)
  Top 0.305: Q3.2 R15.2 v18.57,12.3 | U1.28 49.28,29.52 48.09,30.71 v42.38,30.71 | v42.38,22.46 31.9,22.46 | 31.9,22.46 31.59,22.46 | 31.9,22.46 28.41,22.46 27.77,23.09 v18.57,23.09
  Bottom 0.305: v18.57,23.09 v18.57,12.3 | v42.38,30.71 v42.38,22.46
N$1
  Top 0.305: R30.2 30.95,25 33.02,25 Q6.3
N$2
  Top 0.305: R22.2 R24.1 4.67,25.64 X2.5
N$2OO
  Top 0.305: R42.1 62.7,35.16 IC5.1
N$3
  Top 0.305: R23.2 | D3.3 10.63,32.79 10.63,35.16 R23.2 | R25.1 12.85,35.8 R23.2
N$4  (via drill 0.35)
  Top 0.305: R1.1 v59.84,14.84
  Bottom 0.305: v59.84,14.84 59.84,7.86 J2.6
N$5
  Top 0.305: R30.1 29.68,26.9 29.68,26.91 28.19,26.91 LED1.C
N$7
  Top 1.27: Q10.2 88.42,10.23 88.42,11.35 90.32,11.35 91.28,12.3 91.28,21.19 95.4,25.31 X3.2
N$8
  Top 0.305: 10.63,22.63 D4.3 | D4.3 10.63,22.93 R24.2 11.58,25.64 11.9,25.95 R26.1 | D4.3 10.95,22.78
N$9
  Top 0.305: 63.29,26.27 IC4.1 62.7,26.27 R39.1
N$10
  Top 0.305: R38.1 61.11,22.46 IC4.4
N$12
  Top 0.406: Q11.1 71.91,21.51 71.91,23.09 70,25 IC4.7
N$13
  Top 0.406: Q10.1 73.02,10.08 72.22,10.08 72.22,12.94 70.64,14.52 70.64,21.82 70,22.46 IC4.5
N$14
  Top 1.27: Q11.2 88.73,23.73 90.17,23.73 95.25,28.81 X3.3
N$15
  Top 0.406: IC5.7 70.32,33.89 70.95,34.52 70.95,43.1 72.22,44.37 72.22,45.32 72.54,45.64 Q13.1
N$16
  Top 0.406: IC5.5 71.59,31.35 73.66,33.42 Q12.1
N$17
  Top 1.27: X3.4 86.37,32.31 Q12.2
N$18
  Top 1.27: 85.41,43.1 Q13.2 88.42,39.77 88.42,38.65 90.32,38.65 93.16,35.81 X3.5
N$20
  Top 0.305: R21.2 8.73,37.38 R23.1 | R23.1 | R23.1 4.33,35.8 X2.2
N$23  (via drill 0.35, 0.5)
  Top 0.508: C2.+ 62.74,2.82 61.75,1.82 v60.8,1.82 | D1.A v38.89,1.82
  Top 0.61: C2.+ 62.38,3.45 62.38,8.2 IC1.4
  Bottom 0.508: v60.8,1.82 v38.89,1.82
N$26
  Top 0.305: R33.1 R34.1 24.6,16.43 24.92,16.11 24.92,15.79 J1.5
N$27
  Top 0.305: Q9.1 28.68,16.74 R34.2 25.55,17.7 25.55,18.02 C20.1 24.29,19.29 22.84,19.29 D5.3
N$38
  Top 0.305: U1.8 36,33.57 33.49,33.57 | 33.49,33.57 Q1.2 | C14.1 27.46,31.04 27.46,32.94 28.09,33.57 33.49,33.57
N$39
  Top 0.305: U1.9 35.95,32.06 35.71,32.3 Q1.1 31.59,32.3 31.27,31.98 C15.1
N$102
  Top 0.305: IC2.4 36.78,9.12 38.57,9.12 38.89,9.44 C5.1
N$2001
  Top 0.305: IC5.4 61.07,31.35 60.75,31.03 R43.1
P1  (via drill 0.35)
  Top 0.305: U1.26 49.28,26.98 47.46,28.81 v44.28,28.81 | v44.28,20.55 32.86,20.55 32.54,20.24 R35.1 29.83,18.65 Q9.3
  Bottom 0.305: v44.28,28.81 v44.28,20.55
PWM0  (via drill 0.35)
  Top 0.305: 61.11,26.59 R36.1 61.11,26.91 v62.06,26.91 62.38,26.91 62.7,27.22 64.61,27.22 64.92,26.91 64.92,25.32 64.61,25 IC4.2 | U1.29 54.68,30.8 v55.72,29.76
  Bottom 0.305: v62.06,26.91 61.43,27.54 57.94,27.54 v55.72,29.76
PWM1  (via drill 0.35)
  Top 0.305: IC4.8 69.37,26.31 v69.37,27.22 | v62.06,28.18 61.43,28.18 R37.1 | U1.30 54.68,32.06 v55.72,31.03
  Bottom 0.305: v69.37,27.22 63.02,27.22 v62.06,28.18 61.43,28.81 57.94,28.81 56.35,30.4 v55.72,31.03
PWM2  (via drill 0.35)
  Top 0.305: R40.1 61.11,35.8 v62.06,35.8 62.38,35.8 62.7,36.11 64.61,36.11 64.92,35.8 64.92,34.21 64.61,33.89 IC5.2 | v55.72,33.57 54.48,33.57 U1.31
  Bottom 0.305: v62.06,35.8 57.94,35.8 v55.72,33.57
PWM3  (via drill 0.35)
  Top 0.305: IC5.8 69.37,35.2 v69.37,36.11 | R41.1 61.43,37.06 v62.06,37.06 | 55.4,36.11 v55.72,36.11 54.48,36.11 U1.33
  Bottom 0.305: v69.37,36.11 63.02,36.11 v62.06,37.06 56.67,37.06 v55.72,36.11